# EAGLE schematic diferencial-733 (EAGLE 7.2.0)
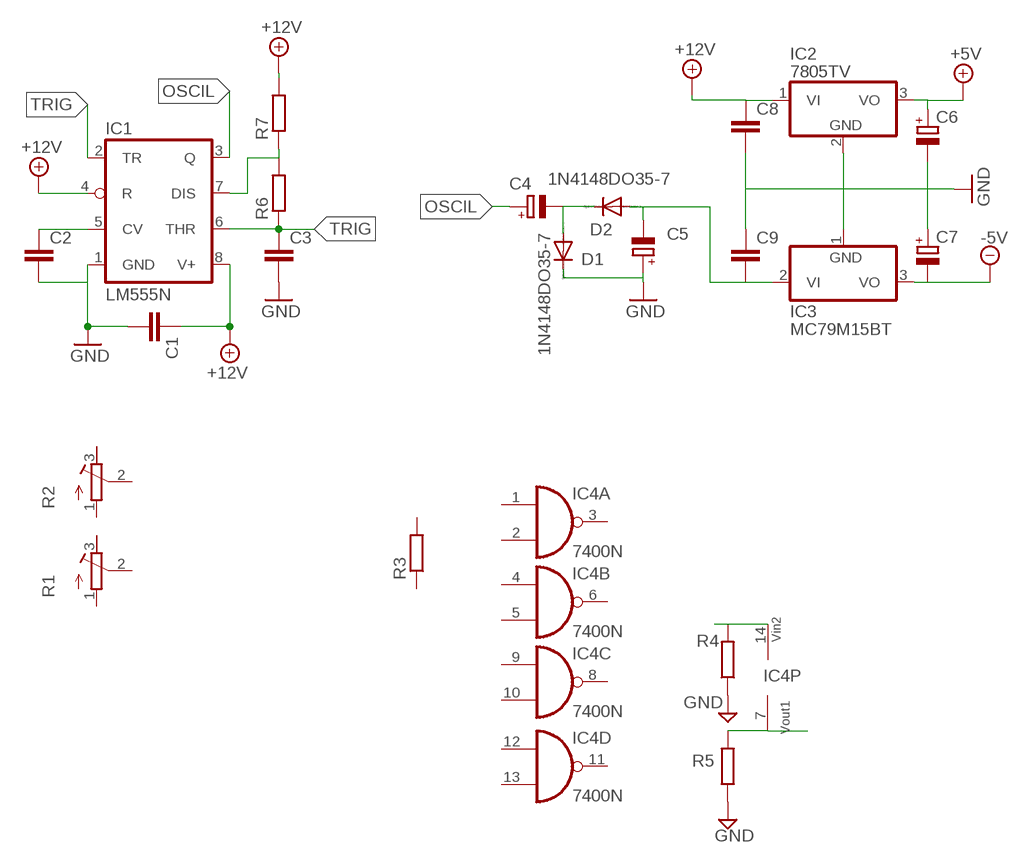
[diagram p0: schematic, sheet 1]

## Parts
C1  C-EU050-025X075  [C050-025X075]
C2  C-EU050-025X075  [C050-025X075]
C3  C-EU025-025X050  [C025-025X050]
C4  CPOL-EUE2.5-6  [E2,5-6]
C5  CPOL-EUE2.5-7  [E2,5-7]
C6  CPOL-EUE2.5-5  [E2,5-5]
C7  CPOL-EUE2.5-5  [E2,5-5]
C8  C-EU025-025X050  [C025-025X050]
C9  C-EU025-025X050  [C025-025X050]
D1  1N4148DO35-7  [DO35-7]
D2  1N4148DO35-7  [DO35-7]
IC1  LM555N  [DIL08]
IC2  7805TV  [TO220V]
IC3  MC79M15BT  [TO220V]
IC4  7400N  [DIL14]
R1  R-TRIMM64W  [RTRIM64W]
R2  R-TRIMM64W  [RTRIM64W]
R3  R-EU_0207/7  [0207/7]
R4  R-EU_0207/7  [0207/7]
R5  R-EU_0207/7  [0207/7]
R6  R-EU_0207/7  [0207/7]
R7  R-EU_0207/7  [0207/7]

## Nets
+5V: C6.+ IC2.3(VO)
+12V: C1.1 C8.1 IC1.4(R) IC1.8(V+) IC2.1(VI) R7.2
-5V: IC3.3(VO)
-VCC: C5.- C9.2 D2.A IC3.2(VI)
GND: C1.2 C2.2 C3.2 C5.+ C6.- C7.+ C8.2 C9.1 D1.C IC1.1(GND) IC2.2(GND) IC3.1(GND) R4.1 R5.1
N$1: IC4.14(P:VCC) R4.2
N$2: IC4.7(P:VOUT2) R5.2
N$3: C2.1 IC1.5(CV)
N$4: C4.- D1.A D2.C
N$5: IC1.7(DIS) R6.2 R7.1
OSCIL: C4.+ IC1.3(Q)
TRIG: C3.1 IC1.2(TR) IC1.6(THR) R6.1
Unconnected: C7.- IC4.1(A:I0) IC4.2(A:I1) IC4.3(A:O) IC4.4(B:I0) IC4.5(B:I1) IC4.6(B:O) IC4.8(C:O) IC4.9(C:I0) IC4.10(C:I1) IC4.11(D:O) IC4.12(D:I0) IC4.13(D:I1) R1.1(A) R1.2(S) R1.3(E) R2.1(A) R2.2(S) R2.3(E) R3.1 R3.2

## Library data of the parts
C1-C3 C8 C9 = rcl:C-EU: CAPACITOR, European symbol
C4-C7 = rcl:CPOL-EU: POLARIZED CAPACITOR, European symbol
D1 D2 = diode:1N4148: DIODE high speed (Philips)
IC1 = linear:*555: TIMER
IC2 = linear:78*: Positive VOLTAGE REGULATOR Source: http://cache.national.com/ds/LM/LM78L05.pdf http://www.fairchildsemi.com/ds/LM/LM7805.pdf
IC3 = linear:MC79M: 500 mA Negative Voltage Regulators Source: Data sheet <http://www.onsemi.com/pub_link/Collateral/MC79M00-D.PDF>
IC4 = 74xx-eu:74*00: Quad 2-input NAND gate
R1 R2 = resistor:R-TRIMM: Trimm resistor
R3-R7 = rcl:R-EU_: RESISTOR, European symbol